# Altium schematic sheet CL10B104KB8NNNC.schdoc
size 127 x 101 mm
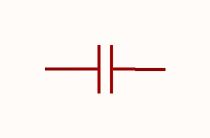
[diagram p0: CL10B104KB8NNNC.schdoc]

## Parts
C?  cl10b104kb8nnnc  [C0603]  (value not drawn)

## Nets

Not connected (* = marked no-connect by the designer): C? 1 2

## Library data of the parts
C? = cl10b104kb8nnnc: 容值:100nF;精度:±10%;额定电压:50V;温度系数:X7R;; Manufacturer: SAMSUNG(三星); AddInBom: yes; ModelId: ac125912035d415993ca9572d50418b1; ModelName: C0603_L1.6-W0.8-H0.8; ModelTransform: 62.992,31.496,0,0,0,0,0,0,0; Value: 100nF; Tolerance: ±10%; Voltage Rating: 50V; Temperature Coefficient: X7R; Symbol: CL10B104KB8NNNC; LCSC Part Name: 100nF ±10% 50V; SupplierPart: C1591; ManufacturerPart: CL10B104KB8NNNC; Supplier Footprint: 0603; JLCPCB Part Class: Extended Part; Datasheet: https://item.szlcsc.com/datasheet/CL10B104KB8NNNC/1943.html; Supplier: LCSC; ConvertToPcb: yes; FootprintName: C0603